# EAGLE schematic sensors and sd card v1 (EAGLE 9.7.0)
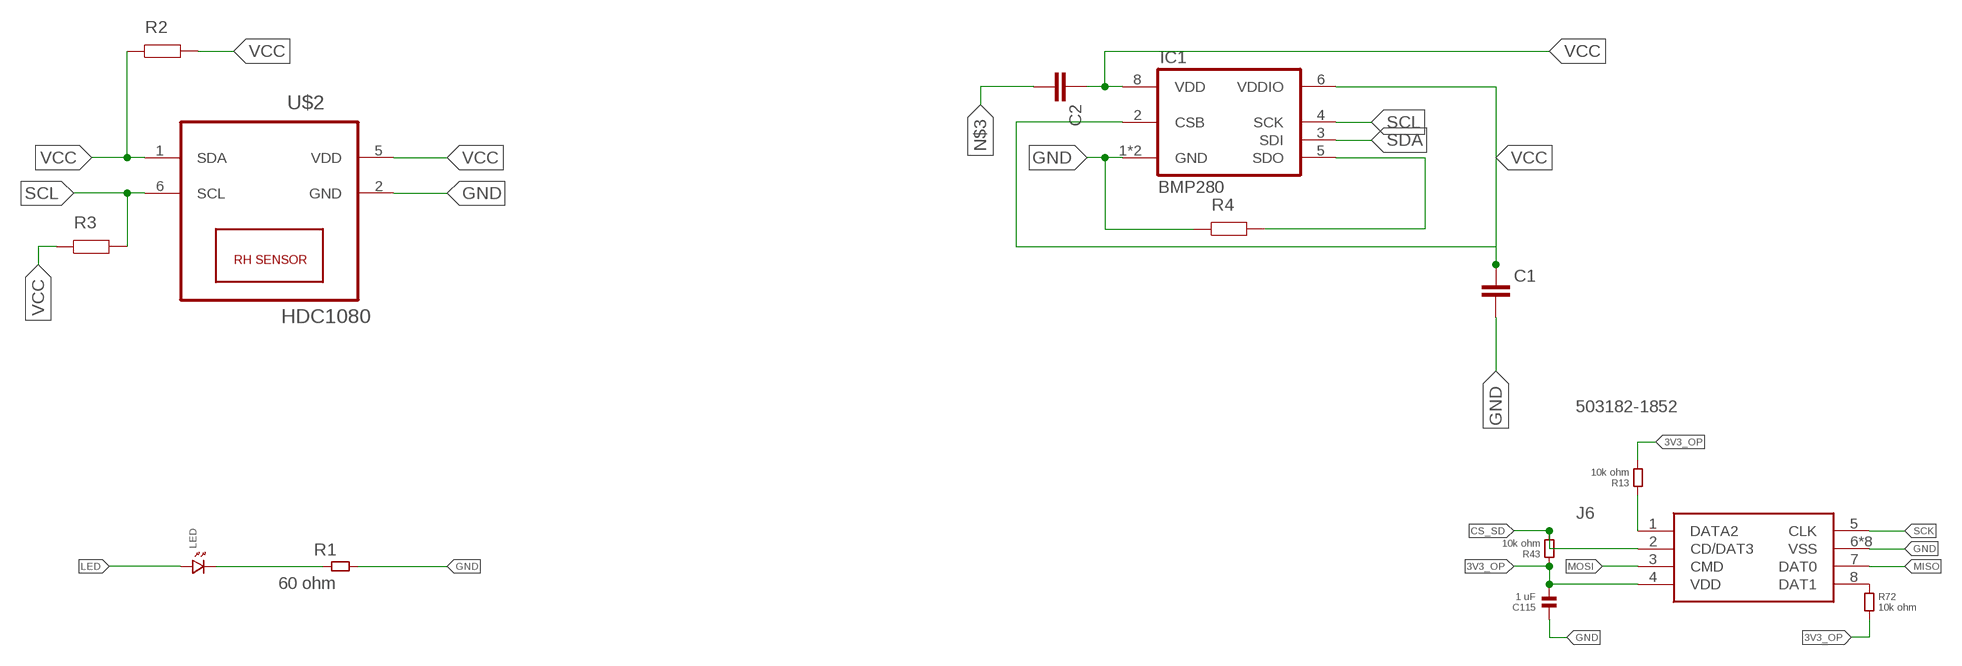
[diagram p0: schematic, sheet 1]

## Parts
C1  C  (no package)
C2  C  (no package)
C115  1 uF  CAPACITOR.0603  [0603]
IC1  BMP280  [BMP280]
J6  503182-1852  [5031821852]
LED  LED.0603  [0603.LED]
R1  60 ohm  RESISTOR.0603  [0603]
R2  R  (no package)
R3  R  (no package)
R4  R  (no package)
R13  10k ohm  RESISTOR.0603  [0603]
R43  10k ohm  RESISTOR.0603  [0603]
R72  10k ohm  RESISTOR.0603  [0603]
U$2  HDC1080  [TI-S-PWSON-N6]

## Nets
3V3_OP: C115.2 J6.4(VDD) R13.2 R43.1 R72.2
CS_SD: J6.2(CD/DAT3) R43.2
GND: C1.2 C115.1 IC1.1(GND) IC1.7(GND) J6.6(VSS) J6.9(VSS) J6.10(VSS) J6.11(VSS) J6.12(VSS) J6.13(VSS) J6.14(VSS) J6.15(VSS) R1.2 R4.1 U$2.2(GND)
LED: LED.P$1
MISO: J6.7(DAT0)
MOSI: J6.3(CMD)
N$1: IC1.5(SDO) R4.2
N$2: LED.P$2 R1.1
N$3: C2.2
N$8: J6.1(DATA2) R13.1
N$12: J6.8(DAT1) R72.1
SCK: J6.5(CLK)
SCL: IC1.4(SCK) R3.2 U$2.6(SCL)
SDA: IC1.3(SDI)
VCC: C1.1 C2.1 IC1.2(CSB) IC1.6(VDDIO) IC1.8(VDD) R2.1 R2.2 R3.1 U$2.1(SDA) U$2.5(VDD)

## Library data of the parts
C1 C2 = ngspice-simulation:C: CAPACITOR
C115 = standardparts:CAPACITOR
IC1 = BMP280-standalone:BMP280: The BMP280 is an absolute barometric pressure sensor especially designed for mobile applications. The sensor module is housed in an extremely compact 8-pin metal-lid LGA package with a footprint of only 2.0 × 2.5 mm2 and 0.95 mm package height. Its small dimensions and its low power consumption of 2.7 μA @1Hz allow the implementation in battery driven devices such as mobile phones, GPS modules or watches. The library has been designed by Richard Magdycz <https://www.facebook.com/groups/eaglecadsoftUK>
J6 = 503182-1852:503182-1852: Micro SD Normal UltraLowPro8CktEmbsTpPkg Source: Datasheet <https://www.molex.com/pdm_docs/sd/5031821852_sd.pdf>; DESCRIPTION: Micro SD Normal UltraLowPro8CktEmbsTpPkg; HEIGHT: mm; MANUFACTURER_NAME: Molex; MANUFACTURER_PART_NUMBER: 503182-1852
LED = standardparts:LED
R1 R13 R43 R72 = standardparts:RESISTOR
R2-R4 = ngspice-simulation:R: RESISTOR
U$2 = Texas-HDC1080:HDC1080